# Altium schematic sheet Power.SchDoc
size A3; SheetNumber: 9; SheetTotal: 9
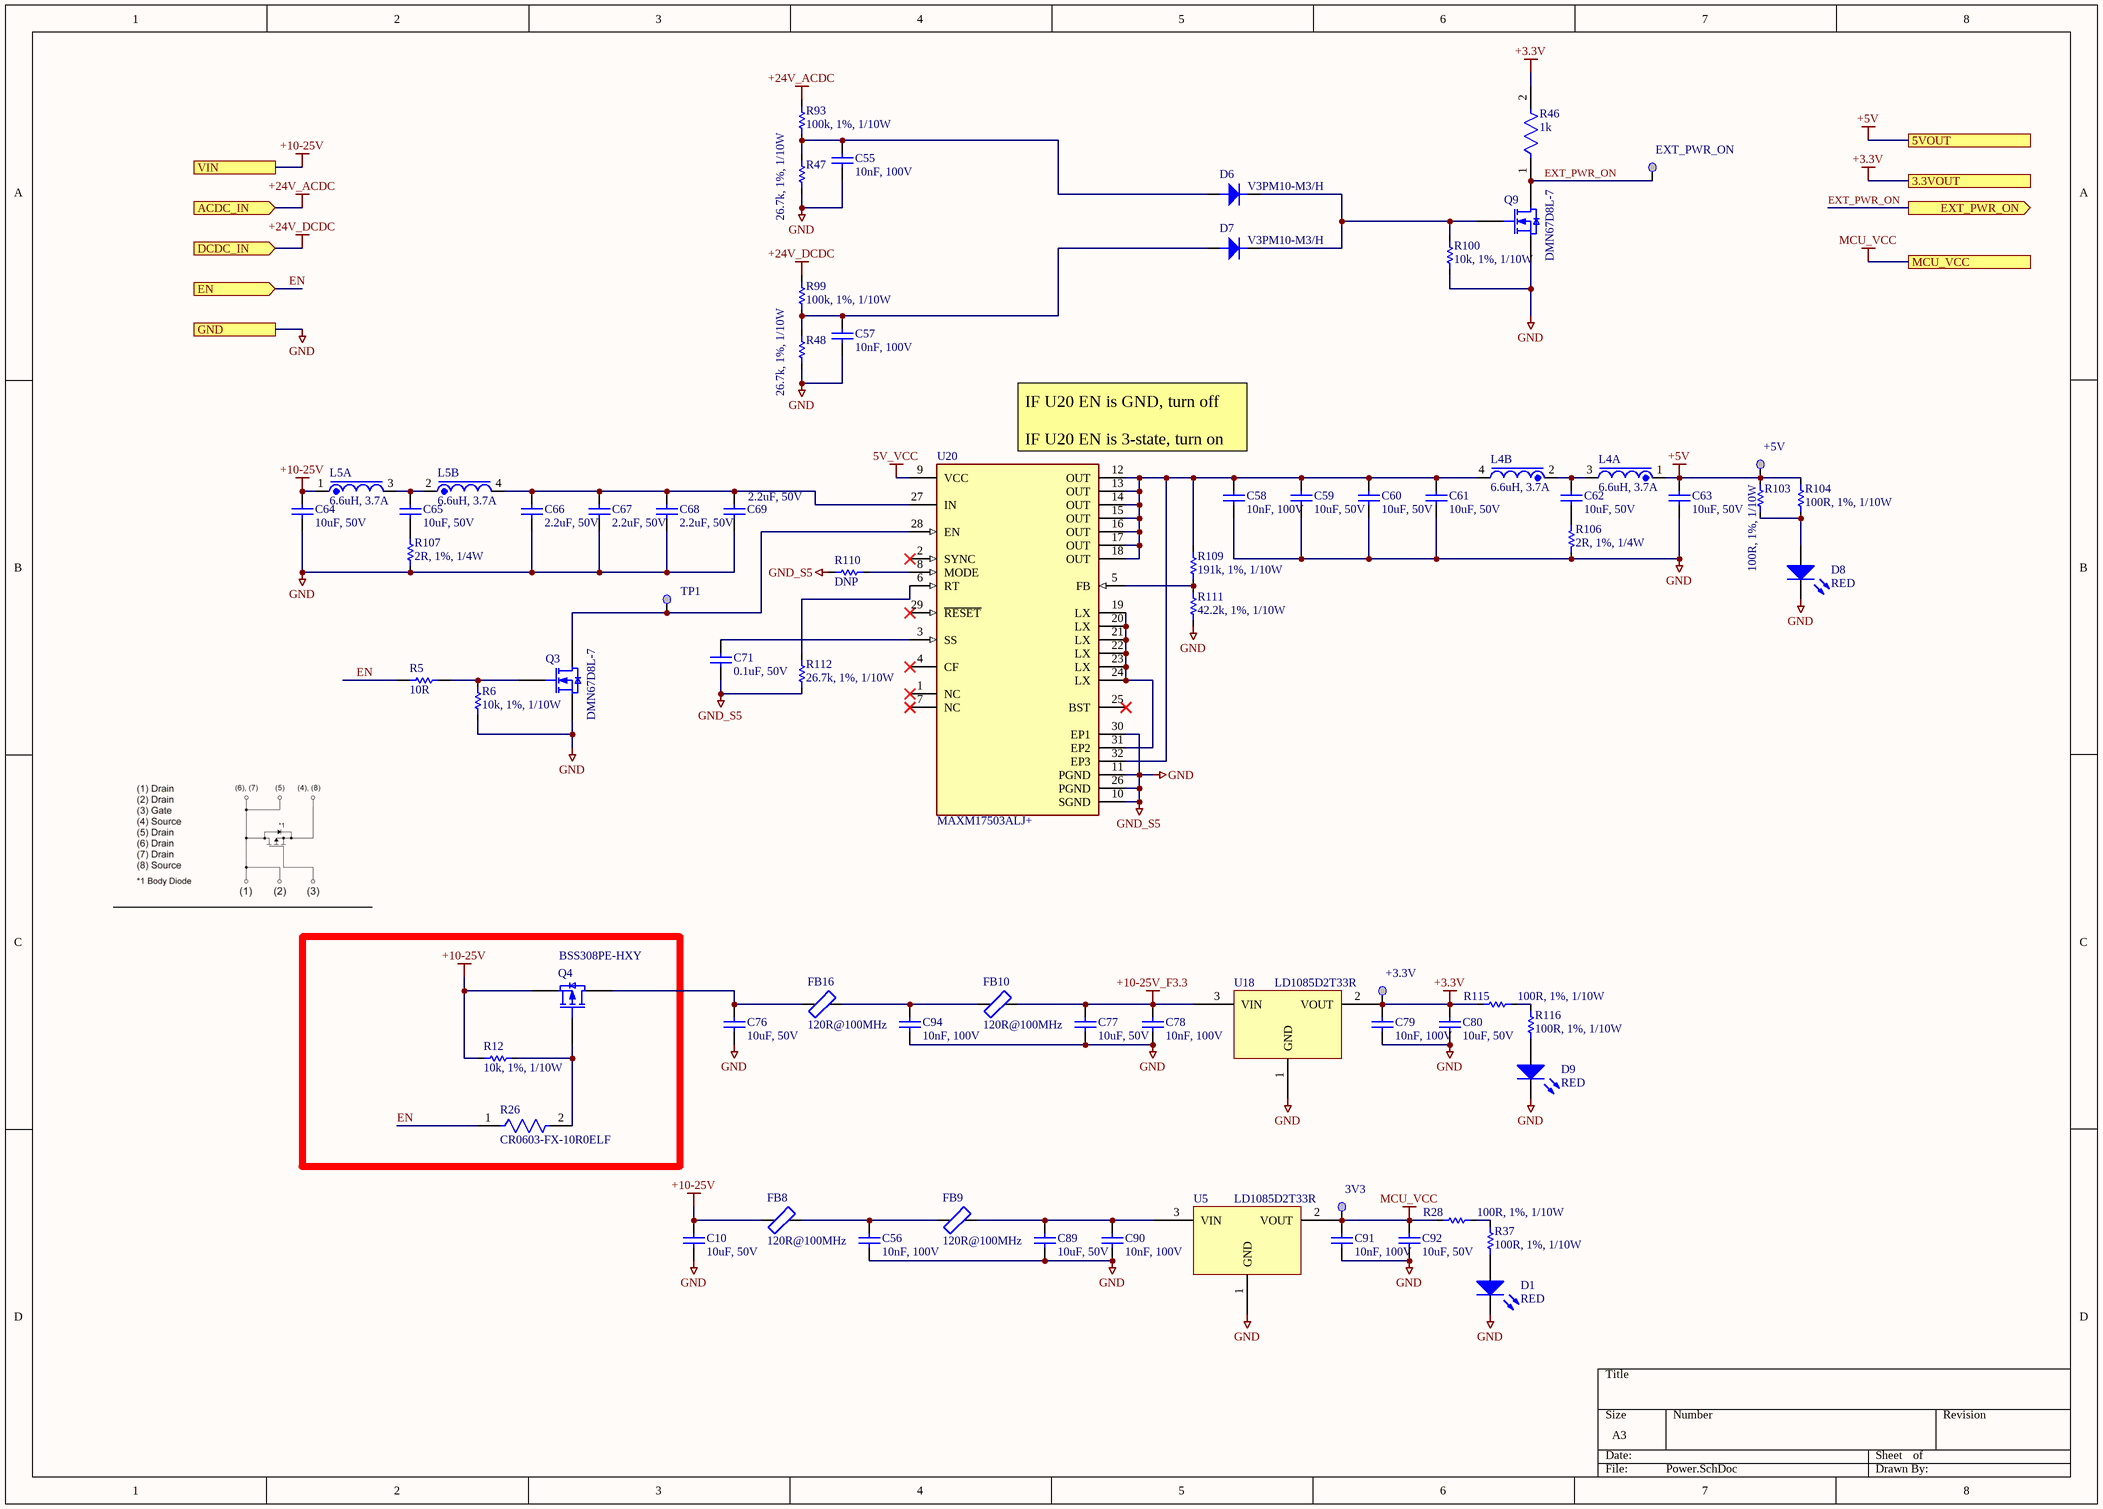
[diagram p0: Power.SchDoc]

## Parts
3V3  Test Point  [TEST POINT 40 Mil]  (value not drawn)  (no BOM)
+3.3V  Test Point  [TEST POINT 40 Mil]  (value not drawn)  (no BOM)
+5V  Test Point  [TEST POINT 40 Mil]  (value not drawn)  (no BOM)
C10  10uF, 50V  [1206]
C55  10nF, 100V  [0603]
C56  10nF, 100V  [0603]
C57  10nF, 100V  [0603]
C58  10nF, 100V  [0603]
C59  10uF, 50V  [1206]
C60  10uF, 50V  [1206]
C61  10uF, 50V  [1206]
C62  10uF, 50V  [1206]
C63  10uF, 50V  [1206]
C64  10uF, 50V  [1206]
C65  10uF, 50V  [1206]
C66  2.2uF, 50V  [1206]
C67  2.2uF, 50V  [1206]
C68  2.2uF, 50V  [1206]
C69  2.2uF, 50V  [1206]
C71  0.1uF, 50V  [0805]
C76  10uF, 50V  [1206]
C77  10uF, 50V  [1206]
C78  10nF, 100V  [0603]
C79  10nF, 100V  [0603]
C80  10uF, 50V  [1206]
C89  10uF, 50V  [1206]
C90  10nF, 100V  [0603]
C91  10nF, 100V  [0603]
C92  10uF, 50V  [1206]
C94  10nF, 100V  [0603]
D1  RED  [0603D]
D6  V3PM10-M3/H  [SMP]
D7  V3PM10-M3/H  [SMP]
D8  RED  [0603_DIODE_K1A2]
D9  RED  [0603_DIODE_K1A2]
EXT_PWR_ON  Test Point  [TEST POINT 40 Mil]  (value not drawn)  (no BOM)
FB8  120R@100MHz  [1206]
FB9  120R@100MHz  [1206]
FB10  120R@100MHz  [1206]
FB16  120R@100MHz  [1206]
L4  6.6uH, 3.7A  [PLCC300P1250X1250X600-4N]  (parts A,B of 2)
L5  6.6uH, 3.7A  [PLCC300P1250X1250X600-4N]  (parts A,B of 2)
Q3  DMN67D8L-7  [SOT23-3]
Q4  BSS308PE-HXY  [SOT-23]
Q9  DMN67D8L-7  [SOT23-3]
R5  10R  [RESC1608X55X25NL10T15]
R6  10k, 1%, 1/10W  [0603]
R12  10k, 1%, 1/10W  [0603]
R26  CR0603-FX-10R0ELF  [FP-CR0603-MFG]
R28  100R, 1%, 1/10W  [0603]
R37  100R, 1%, 1/10W  [0603]
R46  1k  [FP-MCT0603-MFG]
R47  26.7k, 1%, 1/10W  [0603]
R48  26.7k, 1%, 1/10W  [0603]
R93  100k, 1%, 1/10W  [0603]
R99  100k, 1%, 1/10W  [0603]
R100  10k, 1%, 1/10W  [0603]
R103  100R, 1%, 1/10W  [0603]
R104  100R, 1%, 1/10W  [0603]
R106  2R, 1%, 1/4W  [1206]
R107  2R, 1%, 1/4W  [1206]
R109  191k, 1%, 1/10W  [0603]
R110  DNP  [0603]
R111  42.2k, 1%, 1/10W  [0603]
R112  26.7k, 1%, 1/10W  [0603]
R115  100R, 1%, 1/10W  [0603]
R116  100R, 1%, 1/10W  [0603]
TP1  Test Point  [TEST POINT 40 Mil]  (value not drawn)  (no BOM)
U5  LD1085D2T33R  [D2PAK]
U18  LD1085D2T33R  [D2PAK]
U20  MAXM17503ALJ+  [FP-L32915-3-MFG]

## Ports
3.3VOUT, 5VOUT, ACDC_IN (in), DCDC_IN (in), EN (in), EXT_PWR_ON (out), GND, MCU_VCC, VIN

## Nets
5V_VCC: U20.9(VCC)
+3.3V: +3.3V.1 C79.2 C80.2 R46.2 R115.2 U18.2(VOUT) ; port 3.3VOUT
+5V: +5V.1 C63.2 L4.1 R103.2 R104.2 ; port 5VOUT
+10-25V: C10.2 C64.2 FB8.1 L5.1 Q4.3(S) R12.1 ; port VIN
+10-25V_F3.3: C77.2 C78.2 FB10.2 U18.3(VIN)
+24V_ACDC: R93.1 ; port ACDC_IN
+24V_DCDC: R99.1 ; port DCDC_IN
GND: C10.1 C55.1 C56.1 C57.1 C58.1 C59.1 C60.1 C61.1 C63.1 C64.1 C66.1 C67.1 C68.1 C69.1 C71.1 C76.1 C77.1 C78.1 C79.1 C80.1 C89.1 C90.1 C91.1 C92.1 C94.1 D1.2(K) D8.2(K) D9.2(K) Q3.2(S) Q9.2(S) R6.2 R47.1 R48.1 R100.2 R106.1 R107.1 R110.1 R111.1 R112.1 U5.1(GND) U18.1(GND) U20.10(SGND) U20.11(PGND) U20.26(PGND) U20.30(EP1) ; port GND  [also labelled GND_S5]
MCU_VCC: 3V3.1 C91.2 C92.2 R28.2 U5.2(VOUT) ; port MCU_VCC
EN: R5.1 R26.1 ; port EN
EXT_PWR_ON: EXT_PWR_ON.1 Q9.3(D) R46.1 ; port EXT_PWR_ON
NetC55_2: C55.2 D6.1(A) R47.2 R93.2
NetC56_2: C56.2 FB8.2 FB9.1
NetC57_2: C57.2 D7.1(A) R48.2 R99.2
NetC58_2: C58.2 C59.2 C60.2 C61.2 L4.4 R109.2 U20.12(OUT) U20.13(OUT) U20.14(OUT) U20.15(OUT) U20.16(OUT) U20.17(OUT) U20.18(OUT) U20.32(EP3)
NetC62_1: C62.1 R106.2
NetC62_2: C62.2 L4.2 L4.3
NetC65_1: C65.1 R107.2
NetC65_2: C65.2 L5.2 L5.3
NetC66_2: C66.2 C67.2 C68.2 C69.2 L5.4 U20.27(IN)
NetC71_2: C71.2 U20.3(SS)
NetC76_2: C76.2 FB16.1 Q4.2(D)
NetC89_2: C89.2 C90.2 FB9.2 U5.3(VIN)
NetC94_2: C94.2 FB10.1 FB16.2
NetD1_1: D1.1(A) R37.2
NetD6_2: D6.2(K) D7.2(K) Q9.1(G) R100.1
NetD8_1: D8.1(A) R103.1 R104.1
NetD9_1: D9.1(A) R116.2
NetQ3_1: Q3.1(G) R5.2 R6.1
NetQ3_3: Q3.3(D) TP1.1 U20.28(EN)
NetQ4_1: Q4.1(G) R12.2 R26.2
NetR28_1: R28.1 R37.1
NetR109_1: R109.1 R111.2 U20.5(FB)
NetR110_2: R110.2 U20.8(MODE)
NetR112_2: R112.2 U20.6(RT)
NetR115_1: R115.1 R116.1
NetU20_19: U20.19(LX) U20.20(LX) U20.21(LX) U20.22(LX) U20.23(LX) U20.24(LX) U20.31(EP2)

Not connected (* = marked no-connect by the designer): U20 1(NC)* 2(SYNC)* 4(CF)* 7(NC)* 25(BST)* 29(~{RESET})*

## Notes on the sheet
- IF U20 EN is GND, turn off
  IF U20 EN is 3-state, turn on

## Library data of the parts
3V3 +3.3V +5V EXT_PWR_ON TP1 = Test Point: Test Point 0.3mm; PartType: Mechanical; ComponentLink1Description: Datasheet
C10 C59-C65 C76 C77 C80 C89 C92 = NS00832: CAP CER 10UF 50V X7R 1206; Type: C; Alternatives: Generic; Part Number: NS00832; Value: 10uF, 50V; Supplier 1: Digi-Key; Supplier Part Number 1: 1276-6767-1-ND
C55-C58 C78 C79 C90 C91 C94 = NS00848: CAP CER 10000PF 100V C0G 0603; Type: C; Alternatives: Generic; Part Number: NS00848; Value: 10nF, 100V; Supplier 1: Digi-Key; Supplier Part Number 1: 445-172665-1-ND
C66-C69 = NS00824: CAP CER 2.2UF 50V X7R 1206; Type: C; Alternatives: Generic; Part Number: NS00824; Value: 2.2uF, 50V; Supplier 1: Digi-Key; Supplier Part Number 1: 1276-3137-1-ND
C71 = NS00353: 0.10µF ±10% 50V Ceramic Capacitor X7R 0805 (2012 Metric); Type: C; Alternatives: Generic; Part Number: NS00353; Value: 0.1uF, 50V; Supplier 1: Digi-Key; Supplier Part Number 1: 478-1395-1-ND
D1 D8 D9 = NS00945: LED RED CLEAR 1608 SMD; Type: IC; Part Number: NS00945; Value: RED; ComponentLink1Description: Datasheet; ComponentLink1URL: H:\Doc\Harvatek\B1911USD-20D000114U1930.pdf; Supplier 1: Digi-Key; Supplier Part Number 1: 3147-B1911USD-20D000114U1930CT-ND
D6 D7 = NS00857: SCHOTTKY RECTIFIER 3A 100V SMP; Part Number: NS00857; Type: Diode; Value: V3PM10-M3/H; ComponentLink1Description: Datasheet; ComponentLink1URL: H:\Doc\Vishay\v3pm10.pdf; Supplier 1: Digi-Key; Supplier Part Number 1: 112-V3PM10-M3/HCT-ND
FB8-FB10 FB16 = NS00883: FERRITE BEAD 120 OHM 1206 1LN; Type: Inductor; Part Number: NS00883; Value: 120R@100MHz; ComponentLink1Description: Datasheet; ComponentLink1URL: H:\Doc\Murata\QNFA9148.pdf; Supplier 1: Digi-Key; Supplier Part Number 1: 490-16523-1-ND
L4 L5 = NS00831: INDUCT ARRAY 2 COIL 6.6UH SMD; Type: Inductor; Part Number: NS00831; Value: 6.6uH, 3.7A; ComponentLink1Description: Datasheet; ComponentLink1URL: H:\Doc\pulse\SPM2007_28.pdf; Supplier 1: Digi-Key; Supplier Part Number 1: 553-3631-ND
Q3 Q9 = NS00873: MOSFET N-CH 60V 210MA SOT23; Type: IC; Published: 8-Jun-2000; LatestRevisionDate: 17-Jul-2002; LatestRevisionNote: Re-released for DXP Platform.; PackageVersion: 1995/1996; PackageReference: E3; Publisher: Altium Limited; Part Number: NS00873; Value: DMN67D8L-7; ComponentLink1Description: Datasheet; ComponentLink1URL: H:\Doc\Diodes\DMN67D8L.pdf; Supplier 1: Digi-Key; Supplier Part Number 1: DMN67D8L-7DICT-ND
Q4 = NS00810: P-CHANNEL MOSFET, / BSS308PE-HXY; Type: IC; Part Number: NS00810; Value: BSS308PE-HXY; ComponentLink1Description: Datasheet; ComponentLink1URL: H:\Doc\MicroCommercial\MCU45P03A(DPAK).pdf; Supplier 1: Digi-Key; Supplier Part Number 1: 353-MCU45P03A-TPCT-ND
R5 = CMP-1659-00008-4: Chip Resistor, 10 Ohm, +/- 1%, 0.1 W, -55 to 155 degC, 0603 (1608 Metric), RoHS, Tape and Reel; Manufacturer: Yageo; Voltage Rating: 50 V; PackageReference: 0603; ComponentLink3Description: Package Specification; Packaging: Tape and Reel; Max Operating Temperature: 155 degC; ComponentLink3URL: http://www.farnell.com/datasheets/443971.pdf; PackageDescription: 2-Pin Surface Mount Device, Body 1.6 x 0.8 mm; ComponentLink1URL: http://www.yageo.com/; Pins: 2; REACH SVHC: No SVHC; RoHSCompliant: true; ComponentLink2URL: http://www.yageo.com/documents/recent/PYu-RC_Group_51_RoHS_L_04.pdf; DatasheetVersion: Rev. 4, 02/2016; Mount: Surface Mount; Package Quantity: 200; Min Operating Temperature: -55 degC; Height: 0.45 mm; Mounting Technology: Surface Mount; ComponentLink1Description: Manufacturer URL; ComponentLink2Description: Datasheet; Length: 1.6 mm; Supplier 1: Digi-Key; Supplier Part Number 1: 311-10.0HRTR-ND
R6 R12 R100 = NS00820: RES 10K OHM 1% 1/10W 0603; Alternatives: Generic; Part Number: NS00820; Type: R; Value: 10k, 1%, 1/10W; Supplier 1: Digi-Key; Supplier Part Number 1: RMCF0603FT10K0CT-ND
R26 = CMP-1012-00284-2: Thick Film Chip Resistors 0603 10Ω 0.1W 1% 100ppm/°C; Max Power Dissipation: 100mW; Resistance: 10R; Voltage Rating: 50V; Depth: 0.8mm; REACH SVHC: No SVHC; Package Quantity: 1; Thickness: 457um; Length: 1.6mm; Tolerance: 1%; Width: 0.8mm; Number of Pins: 2; Height: 0.45mm; Military Standard: Not; Features: Moisture Resistant; Packaging: Tape and Reel; Case/Package: 0603; Power Rating: 100mW; Voltage Rating (DC): 50V; Radiation Hardening: No; Mount: Surface Mount; Min Operating Temperature: -55°C; Composition: Thick Film; Max Operating Temperature: 155°C; Termination: SMD/SMT; Temperature Coefficient: 100ppm/°C; Case Code (Imperial): 0603; Case Code (Metric): 1608; Number of Terminations: 2; Contact Plating: Tin
R28 R37 R103 R104 R115 R116 = NS00870: RES 100 OHM 1% 1/10W 0603; Alternatives: Generic; Part Number: NS00870; Type: R; Value: 100R, 1%, 1/10W; Supplier 1: Digi-Key; Supplier Part Number 1: RMCF0603FT100RCT-ND
R46 = CMP-02407-007689-1: RES SMD 1kOHM 1% 1/8W 0603; Power Rating: 125mW; Voltage Rating: 75V; Resistance: 150R; Temperature Coefficient: 25ppm/°C; Tolerance: 0.1%; Length: 0.061inch; Composition: Thin Film; Weight: 7.1E-05oz; Case Code (Imperial): 0603; Voltage Rating (DC): 75V; Termination: SMD/SMT; Max Power Dissipation: 125mW; Case Code (Metric): 1608; Package Quantity: 1; Height: 0.45mm; Radiation Hardening: No; Width: 0.033inch; Max Operating Temperature: 155°C; Case/Package: 0603; Features: Automotive AEC-Q200; Contact Plating: Tin; Packaging: Tape and Reel; Number of Pins: 2; Number of Terminations: 2; REACH SVHC: No SVHC; Depth: 0.85mm; Min Operating Temperature: -55°C; Supplier 1: Digi-Key; Supplier Part Number 1: 311-1.0KGRTR-ND
R47 R48 R112 = NS00823: RES 26.7K OHM 1% 1/10W 0603; Alternatives: Generic; Part Number: NS00823; Type: R; Value: 26.7k, 1%, 1/10W; Supplier 1: Digi-Key; Supplier Part Number 1: RMCF0603FT26K7
R93 R99 = NS00835: RES 100K OHM 1% 1/10W 0603; Alternatives: Generic; Part Number: NS00835; Type: R; Value: 100k, 1%, 1/10W; Supplier 1: Digi-Key; Supplier Part Number 1: RMCF0603FT100KCT-ND
R106 R107 = NS00946: RES 2 OHM 1% 1/4W 1206; Alternatives: Generic; Part Number: NS00946; Type: R; Value: 2R, 1%, 1/4W; Supplier 1: Digi-Key; Supplier Part Number 1: 738-RMCF1206FT2R00CT-ND
R109 = NS00821: RES 191K OHM 1% 1/10W 0603; Alternatives: Generic; Part Number: NS00821; Type: R; Value: 191k, 1%, 1/10W; Supplier 1: Digi-Key; Supplier Part Number 1: RMCF0603FT191KCT-ND
R110 = NS00876: RES 0 OHM JUMPER 1/10W 0603; Value: 0R, 1/10W; Alternatives: Generic; Part Number: NS00876; Type: R; Supplier 1: Digi-Key; Supplier Part Number 1: RMCF0603ZT0R00CT-ND
R111 = NS00822: RES 42.2K OHM 1% 1/10W 0603; Alternatives: Generic; Part Number: NS00822; Type: R; Value: 42.2k, 1%, 1/10W; Supplier 1: Digi-Key; Supplier Part Number 1: RMCF0603FT42K2
U5 U18 = NS00880: IC REG LINEAR 3.3V 3A D2PAK; Part Number: NS00880; Type: IC; Value: LD1085D2T33R; ComponentLink1Description: Datasheet; ComponentLink1URL: H:\Doc\ST\en.CD00001883.pdf; Supplier 1: Digi-Key; Supplier Part Number 1: 497-1222-1-ND
U20 = CMP-05722-000278-1: DC DC CONVERTER 0.9-12V; Output Voltage: 12V; Min Output Voltage: 900mV; Max Input Voltage: 60V; Number of Outputs: 1; Max Output Current: 2.5A; Min Input Voltage: 4.5V; Switching Frequency: 1.8MHz; Voltage - Output 1: 12V; Length: 0.59inch; Mount: Surface Mount; Max Operating Temperature: 125°C; Height: 0.11inch; Width: 0.35inch; Number of Pins: 29; Max Output Voltage: 12V; RoHS Compliant: Yes; Series: Himalaya; Min Operating Temperature: -40°C; Features: UVLO; Packaging: Rail/Tube; Output Current: 2.5A; Case/Package: SMD/SMT; Supplier 1: Digi-Key; Supplier Part Number 1: MAXM17503ALJ+-ND